# Altium schematic sheet Sheet.SchDoc
size 420 x 297 mm; Address1: Address1; Address2: Address2; Address3: Address3; Address4: Address4; DocumentNumber: АБВГ.123456.001 Э3; SheetNumber: 1; Scale: 1:1; DocumentType: Схема электрическая принципиальная; FirstReferrence: АБВГ.123456.001
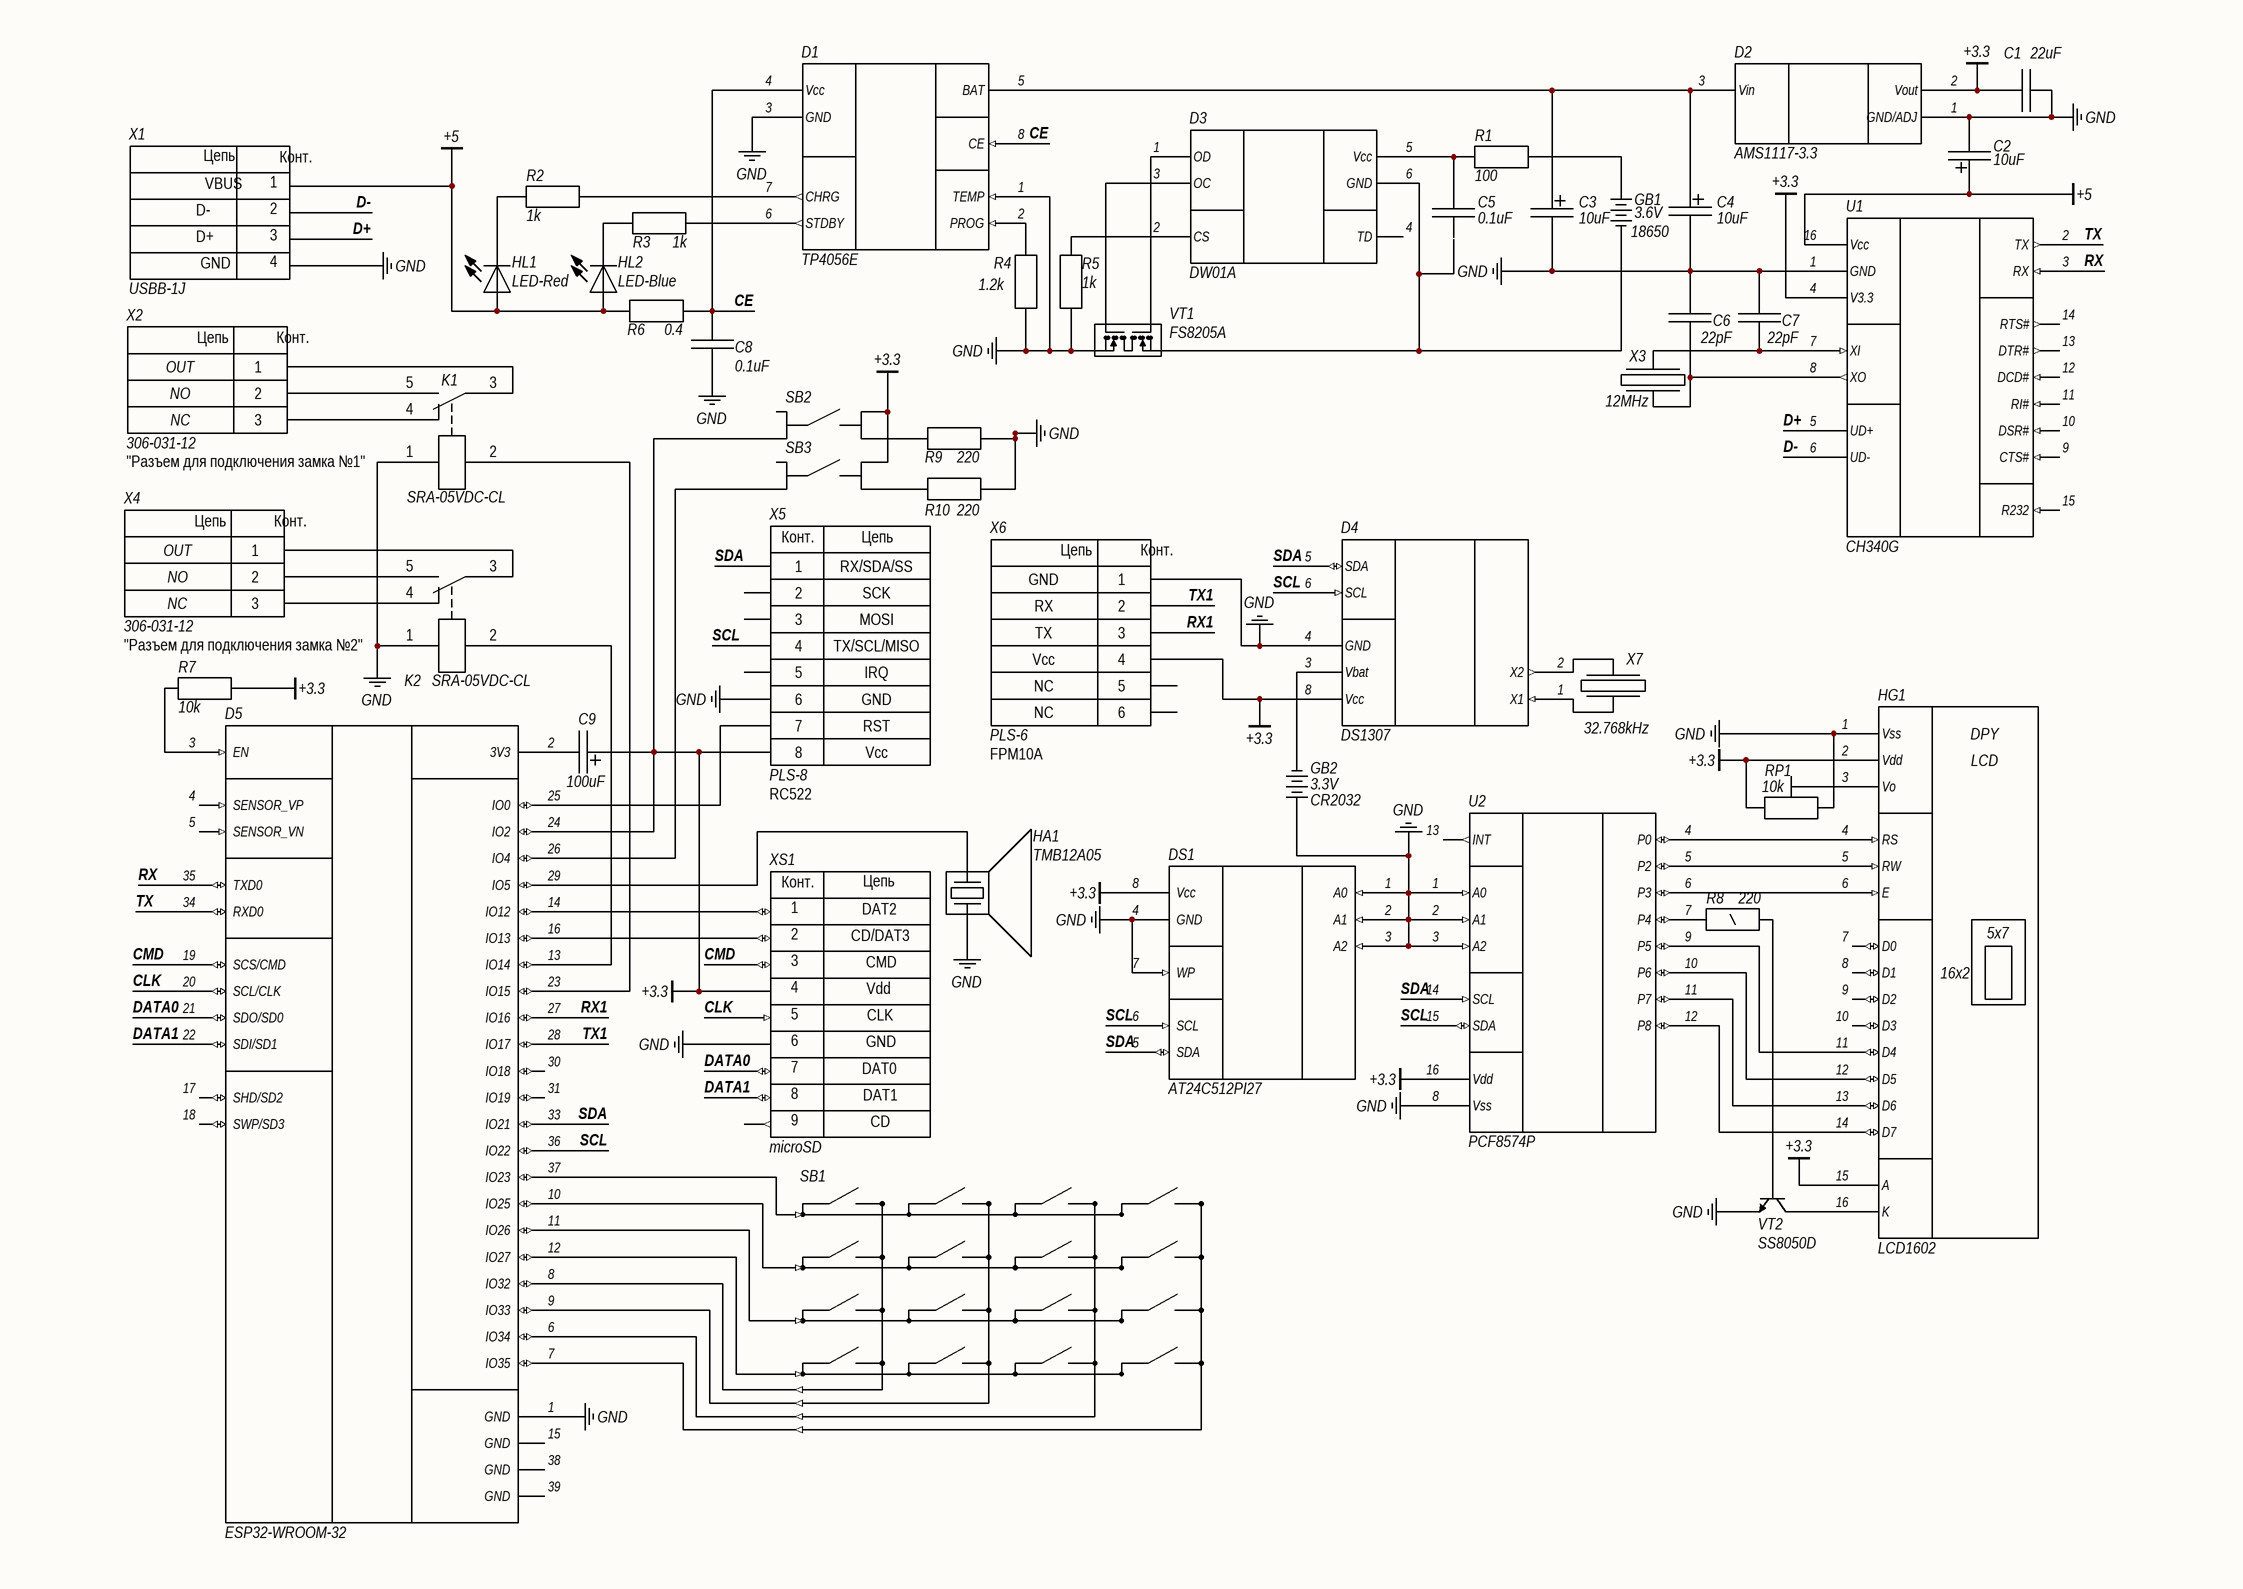
[diagram p0: Sheet.SchDoc]

## Parts
D1  TP4056E
D2  AMS1117-3.3
D3  DW01A
D4  DS1307  [DIP8]
D5  ESP32-WROOM-32
DS1  AT24C512PI27  [DIP8]
GB1  3.6V  Case: 18650
GB2  3.3V  Case: CR2032
HA1  TMB12A05
HG1  LCD1602
HL1  LED-Red
HL2  LED-Blue
K1  SRA-05VDC-CL  [REL: SRD-03VDC]
K2  SRA-05VDC-CL  [REL: SRD-03VDC]
R1  100  [R0402]
R2  1k  [R0402]
R3  1k  [R0402]
R4  1.2k  [R0402]
R5  1k  [R0402]
R6  0.4  [R0402]
R7  10k  [R0402]
R8  220
R9  220  [R0402]
R10  220  [R0402]
RP1  10k
SB1  Матричная Клавиатура 4x4  (value not drawn)
SB2  Кнопка (2-х парная)  (value not drawn)
SB3  Кнопка (2-х парная)  (value not drawn)
U1  CH340G
U2  PCF8574P
VT1  FS8205A
VT2  SS8050D
X1  USBB-1J
X2  306-031-12  CommentText: "Разъем для подключения замка №1"  [CON: DG350-3.5-03P]
X3  12MHz
X4  306-031-12  CommentText: "Разъем для подключения замка №2"  [CON: DG350-3.5-03P]
X5  PLS-8  CommentText: RC522  [CON: PLS-8]
X6  PLS-6  CommentText: FPM10A  [CON: PLS-6]
X7  32.768kHz
XS1  microSD
С1  22uF
С2  10uF
С3  10uF
С4  10uF
С5  0.1uF
С6  22pF
С7  22pF
С8  0.1uF
С9  100uF

## Nets
+3.3: D2.2(Vout) D4.8(Vcc) D5.24(IO2) DS1.8(Vcc) HG1.2(Vdd) HG1.15(A) R7.2 RP1.1 SB2.2 SB2.3 SB3.3 U1.4(V3.3) U2.16(Vdd) X5.8 X6.4 XS1.4(Vdd) С1.1 С9.1
+5: HL1.1 HL2.1 R6.1 U1.16(Vcc) X1.1(VBUS) С2.1
GND: D1.1(TEMP) D1.3(GND) D2.1(GND/ADJ) D4.4(GND) D5.1(GND) DS1.1(A0) DS1.2(A1) DS1.3(A2) DS1.4(GND) DS1.7(WP) GB2.2 HA1.2 HG1.1(Vss) K1.1 K2.1 R4.2 R5.2 R9.2 R10.2 RP1.3 U1.1(GND) U2.1(A0) U2.2(A1) U2.3(A2) U2.8(Vss) VT1.1(S1) VT2.2(E) X1.4(GND) X5.6 X6.1 XS1.6(GND) С1.2 С2.2 С3.2 С4.2 С6.2 С7.2 С8.1
CE: D1.4(Vcc) D1.8(CE) R6.2 С8.2
CLK: D5.20(SCL/CLK) XS1.5(CLK)
CMD: D5.19(SCS/CMD) XS1.3(CMD)
D+: U1.5(UD+) X1.3(D-)
D-: U1.6(UD-) X1.2(D-)
DATA0: D5.21(SDO/SD0) XS1.7(DATA0)
DATA1: D5.22(SDI/SD1) XS1.8(DATA1)
RX: D5.35(TXD0) U1.3(RX)
RX1: D5.27(IO16) X6.3
SCL: D4.6(SCL) D5.36(IO22) DS1.6(SCL) U2.15(SDA) X5.4
SDA: D4.5(SDA) D5.33(IO21) DS1.5(SDA) U2.14(SCL) X5.1
TX: D5.34(RXD0) U1.2(TX)
TX1: D5.28(IO17) X6.2
NetD1_2: D1.2(PROG) R4.1
NetD1_5: D1.5(BAT) D2.3(Vin) GB1.2 R1.2 С3.1 С4.1
NetD1_6: D1.6(STDBY) R3.2
NetD1_7: D1.7(CHRG) R2.2
NetD3_1: D3.1(OD) VT1.4(G2)
NetD3_2: D3.2(CS) R5.1
NetD3_3: D3.3(OC) VT1.6(G1)
NetD3_5: D3.5(Vcc) R1.1 С5.2
NetD3_6: D3.6(GND) GB1.1 VT1.3(S2)
NetD4_1: D4.1(X1) X7.2
NetD4_2: D4.2(X2) X7.1
NetD4_3: D4.3(Vbat) GB2.1
NetD5_2: D5.2(3V3) С9.2
NetD5_3: D5.3(EN) R7.1
NetD5_6: D5.6(IO34) SB1.7
NetD5_7: D5.7(IO35) SB1.8
NetD5_8: D5.8(IO32) SB1.5
NetD5_9: D5.9(IO33) SB1.6
NetD5_10: D5.10(IO25) SB1.2
NetD5_11: D5.11(IO26) SB1.3
NetD5_12: D5.12(IO27) SB1.4
NetD5_13: D5.13(IO14) K2.2
NetD5_14: D5.14(IO12) XS1.1(DAT2)
NetD5_16: D5.16(IO13) XS1.2(CD/DAT3)
NetD5_23: D5.23(IO15) K1.2
NetD5_25: D5.25(IO0) X5.7
NetD5_26: D5.26(IO4) SB3.2
NetD5_29: D5.29(IO5) HA1.1
NetD5_37: D5.37(IO23) SB1.1
NetHG1_3: HG1.3(Vo) RP1.2
NetHG1_4: HG1.4(RS) U2.4(P0)
NetHG1_5: HG1.5(RW) U2.5(P2)
NetHG1_6: HG1.6(E) U2.6(P3)
NetHG1_11: HG1.11(D4) U2.9(P5)
NetHG1_12: HG1.12(D5) U2.10(P6)
NetHG1_13: HG1.13(D6) U2.11(P7)
NetHG1_14: HG1.14(D7) U2.12(P8)
NetHG1_16: HG1.16(K) VT2.3(C)
NetHL1_2: HL1.2 R2.1
NetHL2_2: HL2.2 R3.1
NetK1_3: K1.3 X2.1
NetK1_4: K1.4 X2.3
NetK1_5: K1.5 X2.2
NetK2_3: K2.3 X4.1
NetK2_4: K2.4 X4.3
NetK2_5: K2.5 X4.2
NetR8_1: R8.1 U2.7(P4)
NetR8_2: R8.2 VT2.1(B)
NetR9_1: R9.1 SB2.4
NetR10_1: R10.1 SB3.4
NetU1_7: U1.7(XI) X3.1 С7.1
NetU1_8: U1.8(XO) X3.2 С6.1
NetVT1_2: VT1.2(D1) VT1.5(D2)

Not connected (* = marked no-connect by the designer): D3 4(TD); D5 4(SENSOR_VP) 5(SENSOR_VN) 15(GND) 17(SHD/SD2) 18(SWP/SD3) 30(IO18) 31(IO19) 38(GND) 39(GND); HG1 7(D0) 8(D1) 9(D2) 10(D3); SB2 1; SB3 1; U1 9(CTS#) 10(DSR#) 11(RI#) 12(DCD#) 13(DTR#) 14(RTS#) 15(R232); U2 13(INT); X5 2 3 5; X6 5 6; С5 1

## Notes on the sheet
- Перв. примен.
- Справ. №
- Подп. и дата
- Инв. № дубл.
- Взам. инв. №
- Разраб.
- Изм.
- Лист
- № докум.
- Подп.
- Дата
- Лит.
- Масса
- Масштаб
- Пров.
- Т.контр.
- Листов
- Инв. № подл.
- Утв.
- Н.контр.
- 2.106-A3
- Копировал
- Формат А3
- (in symbol LCD HD44780) DPY
- (in symbol microSD) Цепь; Конт.; DAT0; DAT1; 9
- (in symbol PLS-6) Цепь; Конт.
- (in symbol PLS-8) Конт.; Цепь
- (in symbol USB B) Цепь; Конт.; D+
- (in symbol Винтовой Клеммник 3 Pin) Цепь; Конт.

## Library data of the parts
D1 = TP4056: Контроллер зарядки батарейки.; Manufacturer: NanJing Top Power ASIC Corp.; Case: SOP-8; ComponentLink1Description: Datasheet; ComponentLink1URL: https://static.chipdip.ru/lib/977/DOC002977110.pdf; Model: TP4056E; ComponentLink2Description: Store; ComponentLink2URL: https://aliexpress.ru/item/32982194674.html?spm=a2g0s.9042311.0.0.543133edCjZ4Pa; ComponentLink3Description: HelpURL; ComponentLink3URL: *
D2 = AMS1117: Стабилизатор напряжения.; Manufacturer: Advanced Monolithic Systems; Voltage: 3.3; Model: AMS1117-3.3; ComponentLink1Description: Datasheet; ComponentLink1URL: http://www.advanced-monolithic.com/pdf/ds1117.pdf; Case: SOT223; ComponentLink2Description: Store; ComponentLink2URL: https://aliexpress.ru/item/4000453803123.html?spm=a2g0s.9042311.0.0.543133edCjZ4Pa
D3 = DW01: Защита для литиевого аккумулятора.; Manufacturer: Shenzhen H&M Semiconductor Co. Ltd.; Case: SOT-23-6; ComponentLink1Description: Datasheet; ComponentLink1URL: http://hmsemi.com/downfile/DW01A.PDF; Model: DW01A; ComponentLink2Description: Store; ComponentLink2URL: https://aliexpress.ru/item/32984691553.html?spm=a2g0s.9042311.0.0.543133edCjZ4Pa; ComponentLink3Description: HelpURL; ComponentLink3URL: *
D4 = DS1307: Часы реального времени.; Manufacturer: Dallas Semiconductor; ComponentLink1Description: HelpURL; ComponentLink1URL: *; ComponentLink2Description: Datasheet; ComponentLink2URL: https://www.sparkfun.com/datasheets/Components/DS1307.pdf; Case: DIP-8; Model: DS1307; ComponentLink3Description: Store; ComponentLink3URL: https://aliexpress.ru/item/33022793738.html?spm=a2g0o.cart.0.0.12b13c00qrBLyJ&mp=1
D5 = ESP32-WROOM: Manufacturer: Espressif Systems; Model: ESP32-WROOM-32; ComponentLink1Description: Datasheet; ComponentLink1URL: https://www.espressif.com/sites/default/files/documentation/esp32-wroom-32_datasheet_en.pdf; ComponentLink2Description: Store; ComponentLink2URL: *; ComponentLink3Description: HelpURL; ComponentLink3URL: *
DS1 = AT24C: Перезаписываемая постоянная память.; Manufacturer: Atmel; Device Revision: B; Memory Size: 512 kbit; Case: DIP-8; Model: AT24C512PI27; ComponentLink1Description: Datasheet; ComponentLink1URL: http://ww1.microchip.com/downloads/en/devicedoc/atmel-8720-seeprom-at24c512c-datasheet.pdf; ComponentLink2Description: HelpURL; ComponentLink2URL: https://www.microchip.com/wwwproducts/en/AT24C512C; ComponentLink3Description: Store; ComponentLink3URL: https://aliexpress.ru/item/32598383117.html?spm=a2g0s.9042311.0.0.3da233edDDspR7
GB1 = Батарея: Manufacturer: LG; Model: LGAAS31865; Capacity: 2200mAh; Voltage: 3.6V; ComponentLink1Description: Store; ComponentLink1URL: *; ComponentLink2Description: HelpURL; ComponentLink2URL: *; ComponentLink3Description: Datasheet; ComponentLink3URL: https://www.tme.eu/Document/851884e7c9339fa73b5bf66663baac51/ACCU-ICR18650-2.2.pdf
GB2 = Батарея: Voltage: 3.3V; Model: *; Manufacturer: *; Capacity: *; ComponentLink1Description: Store; ComponentLink1URL: *; ComponentLink2Description: HelpURL; ComponentLink2URL: *; ComponentLink3Description: Datasheet; ComponentLink3URL: *
HA1 = Пьездодинамик: Model: TMB12A05; Manufacturer: *; Diameter: *; Voltage: *; ComponentLink1Description: Datasheet; ComponentLink1URL: *; ComponentLink2Description: Store; ComponentLink2URL: *
HG1 = LCD HD44780: Дисплей на основе контроллера HD44780.; ScreenResolution: 16x2; CharacterResolution: 5x7; Model: LCD1602; Manufacturer: *; Type: LCD; ComponentLink1Description: Store; ComponentLink1URL: *; ComponentLink2Description: Datasheet; ComponentLink2URL: *; ComponentLink3Description: HelpURL; ComponentLink3URL: https://radiolaba.ru/wp-content/uploads/2016/12/LCD1602-PCF8574-I2C-schema.jpg
HL1 HL2 = Светодиод: Case: *; Manufacturer: *; ComponentLink1Description: Datasheet; ComponentLink1URL: *; ComponentLink2Description: HelpURL; ComponentLink2URL: *; Color: *; ComponentLink3Description: Store; ComponentLink3URL: *
  HL1: Model: LED-Red
  HL2: Model: LED-Blue
K1 K2 = Реле SRD-05VDC: Manufacturer: Ningbo Songle; TypeRelay: Electromechanics relay; VoltageMax: 250VAC; VoltageControlCoil: 5VDC; MaxCurrent: 20A; Temperature: -40...+85°C; Model: SRA-05VDC-CL; ComponentLink1Description: Store; ComponentLink1URL: https://aliexpress.ru/item/32836198919.html?spm=a2g0s.9042311.0.0.552533edxtoJXy; ComponentLink2Description: Datasheet; ComponentLink2URL: https://www.circuitbasics.com/wp-content/uploads/2015/11/SRD-05VDC-SL-C-Datasheet.pdf; ComponentLink3Description: HelpURL; ComponentLink3URL: *
R1-R7 R9 R10 = Резистор: Case: *; Manufacturer: *; Model: *; ComponentLink1Description: Datasheet; ComponentLink1URL: *; ComponentLink2Description: HelpURL; ComponentLink2URL: *; Power: *; ComponentLink3Description: Store; ComponentLink3URL: *
  R1: Value: 100
  R2 R3 R5: Value: 1k
  R4: Value: 1.2k
  R6: Value: 0.4
  R7: Value: 10k
  R9 R10: Value: 220
R8 = Резистор 0.25 Вт: Power: 0.25; Case: *; Manufacturer: *; Model: *; ComponentLink1Description: Datasheet; ComponentLink1URL: *; ComponentLink2Description: HelpURL; ComponentLink2URL: *; Value: 220; ComponentLink3Description: Store; ComponentLink3URL: *
RP1 = Подстроечный Резистор: Manufacturer: Bochen; Model: 3296Y-1-103; Case: *; ComponentLink1Description: Datasheet; ComponentLink1URL: https://www.bourns.com/pdfs/3296.pdf; ComponentLink2Description: HelpURL; ComponentLink2URL: *; Value: 10k; Power: *; ComponentLink3Description: Store; ComponentLink3URL: *
U1 = CH340G: Преобразователя интерфейса USB в UART.; Manufacturer: Nanjing Qinheng Microelectronics Co. Ltd.; Case: SOP-16; Model: CH340G; ComponentLink1Description: HelpURL; ComponentLink1URL: http://mypractic.ru/mikrosxema-ch340g-preobrazovatel-interfejsa-usb-v-uart-most-usb-uart-xarakteristiki-usloviya-ekspluatacii-tipovye-sxemy-vklyucheniya.html; ComponentLink2Description: Datasheet; ComponentLink2URL: http://www.wch-ic.com/products/CH340.html?from=search&q=eyJpdiI6InNwMEdrWnhCbzlTczZhZUM2cncxVHc9PSIsInZhbHVlIjoia0FTMDlncDFNZ29zQmJ2ZGJZOTBCZz09IiwibWFjIjoiZGE4NTAzZGQ0ZWQzNzFmMTZkZWFhMWYwOTExNzExNWI5YjhlMzUwMjE3NzYxMzc5MWI2ZmFmZTVlMDQ3ZDAwZiJ9; ComponentLink3Description: Store; ComponentLink3URL: https://aliexpress.ru/item/32836074859.html?spm=a2g0s.9042311.0.0.543133edCjZ4Pa
U2 = PCF8574: IIC расширитель.; Manufacturer: NXT; Model: PCF8574P; Case: DIP-16; ComponentLink1Description: Datasheet №1; ComponentLink1URL: https://www.nxp.com/docs/en/data-sheet/PCF8574_PCF8574A.pdf; ComponentLink2Description: Datasheet №2; ComponentLink2URL: http://www.ti.com/lit/ds/symlink/pcf8574.pdf; ComponentLink3Description: HelpURL; ComponentLink3URL: *; ComponentLink4Description: Store; ComponentLink4URL: https://aliexpress.ru/item/4000480743714.html?spm=a2g0s.9042311.0.0.552533edxtoJXy
VT1 = FS8205: Транзисторная сборка. Если корпус SOIC-8, то смотри подробное условное обозначение. Пины 2 и 5 находятся по середине, в внутренней схеме они соеденины.; Manufacturer: Fortune Semiconductor Corp.; Model: FS8205A; Case: SOT23-6; ComponentLink1Description: Datasheet; ComponentLink1URL: https://www.ic-fortune.com/upload/Download/FS8205A-DS-12_EN.pdf; ComponentLink2Description: Detailed symbol; ComponentLink2URL: https://go-radio.ru/images/8205a.png; ComponentLink3Description: Store; ComponentLink3URL: https://aliexpress.ru/item/4000453813065.html?spm=a2g0s.9042311.0.0.552533edxtoJXy; ComponentLink4Description: HelpURL; ComponentLink4URL: *
VT2 = Биполярный Транзистор: Model: SS8050D; Manufacturer: *; Case: TO-92; ComponentLink1Description: Datasheet; ComponentLink1URL: https://static.chipdip.ru/lib/286/DOC000286377.pdf; ComponentLink2Description: HelpURL; ComponentLink2URL: *; ComponentLink3Description: Store; ComponentLink3URL: https://www.chipdip.ru/product/ss8050d
X1 = USB B: Manufacturer: Molex; TypeConnector: USB B; Model: USBB-1J; ComponentLink1Description: Store; ComponentLink1URL: https://www.chipdip.ru/product/usbb-1j-ds1099-b; ComponentLink2Description: Datasheet; ComponentLink2URL: *; ComponentLink3Description: HelpURL; ComponentLink3URL: *
X2 X4 = Винтовой Клеммник 3 Pin: TypeConnector: Terminal connector; VoltageMax: 300VAC; Pitch: 3.5mm; CurrentMax: 10A; Multichannel: 3pin; Text3: NC; Text2: NO; Text1: OUT; Manufacturer: *; Model: 306-031-12; ComponentLink1Description: Store; ComponentLink1URL: https://www.chipdip.ru/product/306-031-12
X3 X7 = Кварцевый Резонатор: Case: *; Model: *; Manufacturer: *; ComponentLink1Description: Store; ComponentLink1URL: *; ComponentLink2Description: Datasheet; ComponentLink2URL: *; ComponentLink3Description: HelpURL; ComponentLink3URL: *
  X3: Frequency: 12MHz
  X7: Frequency: 32.768kHz
X5 = PLS-8: TypeConnector: Connector; VoltageMax: 500VAC; Pitch: 2.54mm; CurrentMax: 3A; Multichannel: 8pin; Text8: Vcc; Text7: RST; Text6: GND; Text5: IRQ; Text4: TX/SCL/MISO; Text3: MOSI; Text2: SCK; Text1: RX/SDA/SS; Manufacturer: *; Model: PLS-8; ComponentLink1Description: Store; ComponentLink1URL: *
X6 = PLS-6: Manufacturer: Connfly; TypeConnector: Connector; VoltageMax: 500VAC; Pitch: 2.54mm; CurrentMax: 3A; Multichannel: 6pin; Text6: NC; Text4: Vcc; Text3: TX; Text1: GND; Text2: RX; Model: PLS-6; ComponentLink1Description: Store; ComponentLink1URL: *; Text5: NC
XS1 = microSD: Слот для карты памяти.; Manufacturer: Molex; TypeConnector: microSD; Model: *; ComponentLink1Description: Store; ComponentLink1URL: *; ComponentLink2Description: Datasheet; ComponentLink2URL: *; ComponentLink3Description: HelpURL; ComponentLink3URL: https://kicad-info.s3-us-west-2.amazonaws.com/original/2X/8/8d1dbfabaa90b65dad4965a185d7e55230d35003.png
С1 С5-С8 = Конденсатор: Case: *; Manufacturer: *; Model: *; ComponentLink1Description: Datasheet; ComponentLink1URL: *; ComponentLink2Description: HelpURL; ComponentLink2URL: *; Voltage: *; ComponentLink3Description: Store; ComponentLink3URL: *
  С1: Value: 22uF
  С5 С8: Value: 0.1uF
  С6 С7: Value: 22pF
С2-С4 = Конденсатор Полярный: Manufacturer: Epcos; Model: B43851F1106M008; Voltage: 160; Case: К50-35; ComponentLink1Description: Datasheet; ComponentLink1URL: *; ComponentLink2Description: HelpURL; ComponentLink2URL: *; Value: 10uF; ComponentLink3Description: Store
  С2 С3: ComponentLink3URL: *
  С4: ComponentLink3URL: https://www.chipdip.ru/product0/9000383641
С9 = Конденсатор Полярный: Manufacturer: Jamicon; Model: TKR101M1AD11; Voltage: 10V; Case: К50-35; ComponentLink1Description: Datasheet; ComponentLink1URL: *; ComponentLink2Description: HelpURL; ComponentLink2URL: *; Value: 100uF; ComponentLink3Description: Store; ComponentLink3URL: https://www.chipdip.ru/product0/9000247187
SB2 SB3 = Кнопка (2-х парная): ComponentLink1Description: Store; ComponentLink1URL: *; ComponentLink2Description: Datasheet; ComponentLink2URL: *; ComponentLink3Description: HelpURL; ComponentLink3URL: *; Model: *; Size: *; Manufacturer: *